# EAGLE design vestee main (EAGLE 7.5.0)
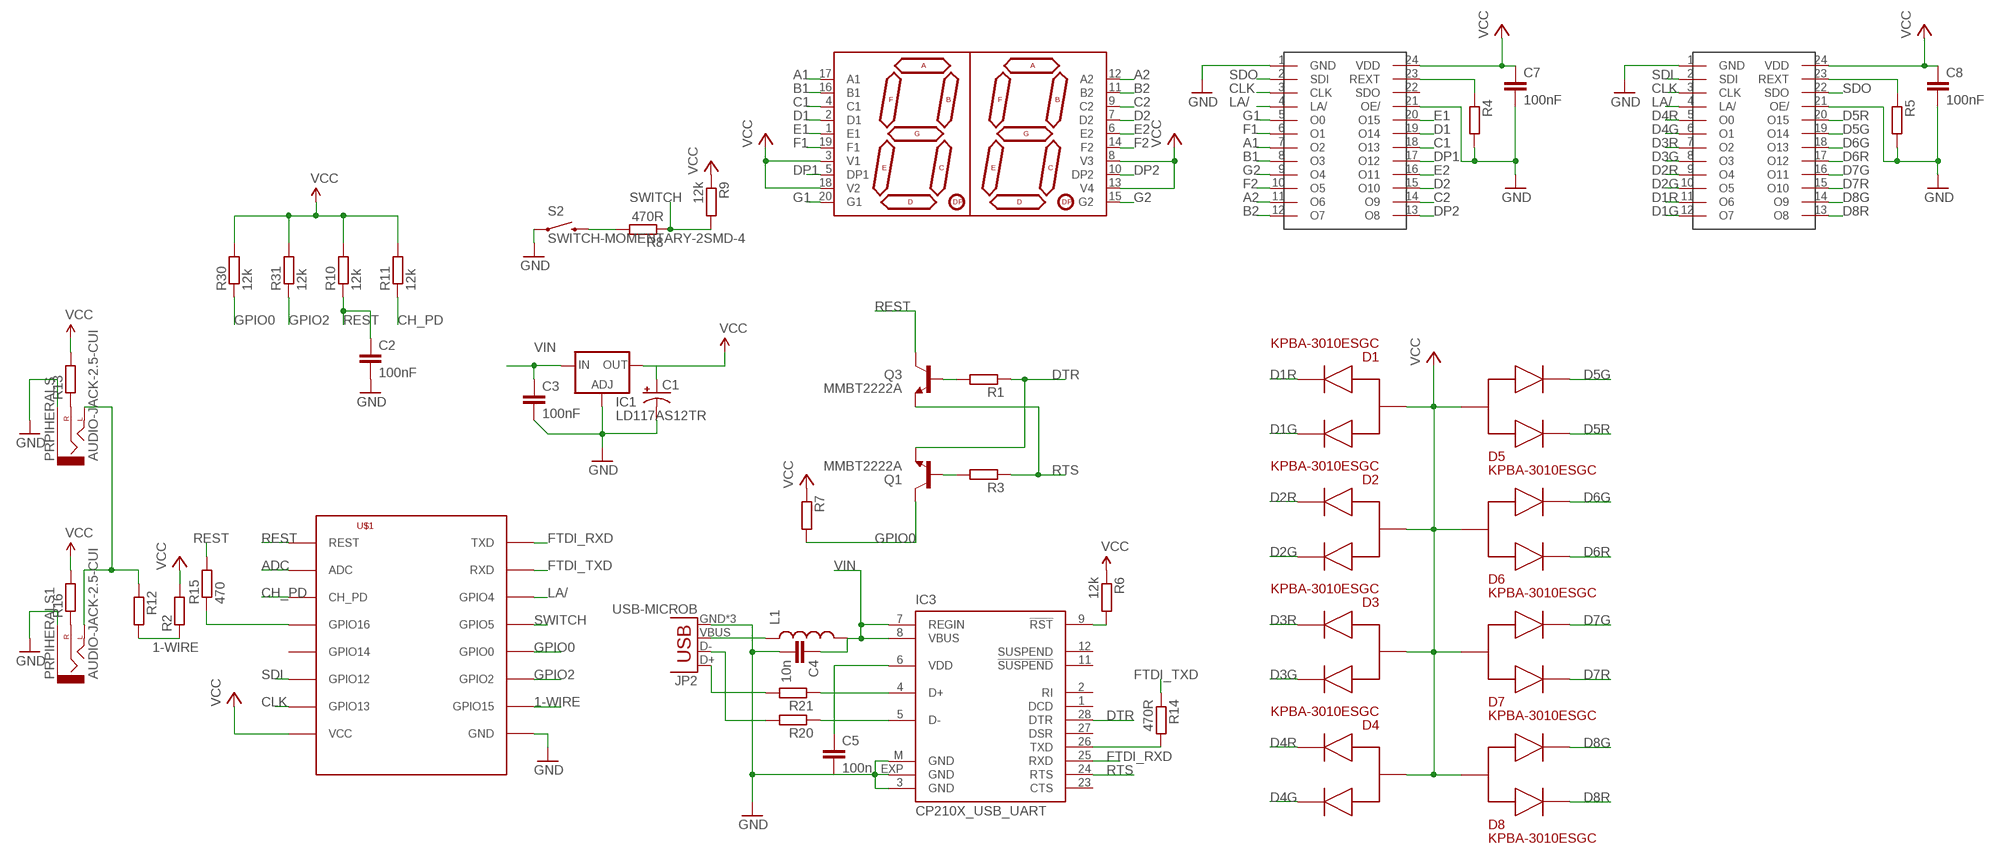
[diagram p0: schematic, sheet 1]

## Parts
C1  CAP_POL3528  [EIA3528]
C2  100nF  C-EUC0603  [C0603]
C3  100nF  C-EUC0603  [C0603]
C4  10n  C-EUC0603  [C0603]
C5  100n  C-EUC0603  [C0603]
C7  100nF  C-EUC0603  [C0603]
C8  100nF  C-EUC0603  [C0603]
D1  KPBA-3010ESGC  APA3010SF4C  [APA3010SF4C]
D2  KPBA-3010ESGC  APA3010SF4C  [APA3010SF4C]
D3  KPBA-3010ESGC  APA3010SF4C  [APA3010SF4C]
D4  KPBA-3010ESGC  APA3010SF4C  [APA3010SF4C]
D5  KPBA-3010ESGC  APA3010SF4C  [APA3010SF4C]
D6  KPBA-3010ESGC  APA3010SF4C  [APA3010SF4C]
D7  KPBA-3010ESGC  APA3010SF4C  [APA3010SF4C]
D8  KPBA-3010ESGC  APA3010SF4C  [APA3010SF4C]
IC1  LD117AS12TR  [SOT223]
IC3  CP210X_USB_UART  [MLP28]
JP2  USB-MICROB  [USB-MICROB]
L1  INDUCTOR1210  [1210]
PRPIHERALS  AUDIO-JACK-2.5-CUI  [STEREOJACK2.5_SMD_CUI]
PRPIHERALS1  AUDIO-JACK-2.5-CUI  [STEREOJACK2.5_SMD_CUI]
Q1  MMBT2222A  TRANSISTOR_NPNMMBT2222A  [SOT23-3]
Q3  MMBT2222A  TRANSISTOR_NPNMMBT2222A  [SOT23-3]
R1  R-EU_R0603  [R0603]
R2  R-EU_R0603  [R0603]
R3  R-EU_R0603  [R0603]
R4  R-EU_R0603  [R0603]
R5  R-EU_R0603  [R0603]
R6  12k  R-EU_R0603  [R0603]
R7  R-EU_R0603  [R0603]
R8  470R  R-EU_R0603  [R0603]
R9  12k  R-EU_R0603  [R0603]
R10  12k  R-EU_R0603  [R0603]
R11  12k  R-EU_R0603  [R0603]
R12  R-EU_R0603  [R0603]
R13  R-EU_M1206  [M1206]
R14  470R  R-EU_R0603  [R0603]
R15  470  R-EU_R0603  [R0603]
R16  R-EU_M1206  [M1206]
R20  R-EU_R0603  [R0603]
R21  R-EU_R0603  [R0603]
R30  12k  R-EU_R0603  [R0603]
R31  12k  R-EU_R0603  [R0603]
S2  SWITCH-MOMENTARY-2SMD-4  [TACTILE_SWITCH_TALL]
U$1  ESP8266-07  [ESP-07]
U$2  KCDA02-103  [KCDA02-103]
U$3  SCT2024CSSG  [SSOP24]
U$4  SCT2024CSSG  [SSOP24]

## Nets
1-WIRE: R2.1 R12.2 U$1.GPIO15
A1: U$2.17(A1) U$3.7(O2)
A2: U$2.12(A2) U$3.11(O6)
ADC: U$1.ADC
B1: U$2.16(B1) U$3.8(O3)
B2: U$2.11(B2) U$3.12(O7)
C1: U$2.4(C1) U$3.18(O13)
C2: U$2.9(C2) U$3.14(O9)
CH_PD: R11.1 U$1.CH_PD
CLK: U$1.GPIO13 U$3.3(CLK) U$4.3(CLK)
D1: U$2.2(D1) U$3.19(O14)
D1G: D1.3 U$4.12(O7)
D1R: D1.2 U$4.11(O6)
D2: U$2.7(D2) U$3.15(O10)
D2G: D2.3 U$4.10(O5)
D2R: D2.2 U$4.9(O4)
D3G: D3.3 U$4.8(O3)
D3R: D3.2 U$4.7(O2)
D4G: D4.3 U$4.6(O1)
D4R: D4.2 U$4.5(O0)
D5G: D5.3 U$4.19(O14)
D5R: D5.2 U$4.20(O15)
D6G: D6.3 U$4.18(O13)
D6R: D6.2 U$4.17(O12)
D7G: D7.3 U$4.16(O11)
D7R: D7.2 U$4.15(O10)
D8G: D8.3 U$4.14(O9)
D8R: D8.2 U$4.13(O8)
DP1: U$2.5(DP1) U$3.17(O12)
DP2: U$2.10(DP2) U$3.13(O8)
DTR: IC3.28(DTR) Q1.2(E) R1.1
E1: U$2.1(E1) U$3.20(O15)
E2: U$2.6(E2) U$3.16(O11)
F1: U$2.19(F1) U$3.6(O1)
F2: U$2.14(F2) U$3.10(O5)
FTDI_RXD: IC3.25(RXD) U$1.TXD
FTDI_TXD: R14.1 U$1.RXD
G1: U$2.20(G1) U$3.5(O0)
G2: U$2.15(G2) U$3.9(O4)
GND: C1.C(-) C2.2 C3.2 C4.2 C5.2 C7.2 C8.2 IC1.1(ADJ) IC3.3(GND) IC3.EXP(GND) IC3.M(GND) JP2.GND JP2.MT1(GND) JP2.MT2(GND) PRPIHERALS1.1(SLEEVE) PRPIHERALS.1(SLEEVE) R4.2 R5.2 S2.A2 U$1.GND U$3.1(GND) U$3.21(OE/) U$4.1(GND) U$4.21(OE/)
GPIO0: Q1.3(C) R7.2 R30.1 U$1.GPIO0
GPIO2: R31.1 U$1.GPIO2
GPIO16: R15.1 U$1.GPIO16
JACK: PRPIHERALS1.3(LEFT) PRPIHERALS.3(LEFT) R12.1
LA/: U$1.GPIO4 U$3.4(LA/) U$4.4(LA/)
N$1: R4.1 U$3.23(REXT)
N$2: JP2.D+ R21.2
N$3: JP2.D- R20.2
N$4: R5.1 U$4.23(REXT)
N$5: Q3.1(B) R1.2
N$6: PRPIHERALS.2(RIGHT) R13.1
N$7: JP2.VBUS L1.1
N$8: PRPIHERALS1.2(RIGHT) R16.1
N$9: C5.1 IC3.6(VDD)
N$14: IC3.9(!RST) R6.2
N$15: Q1.1(B) R3.2
N$18: R8.2 S2.B2
N$28: IC3.4(D+) R21.1
N$29: IC3.5(D-) R20.1
REST: C2.1 Q3.3(C) R10.1 R15.2 U$1.REST
RTS: IC3.24(RTS) Q3.2(E) R3.1
SDI: U$1.GPIO12 U$4.2(SDI)
SDO: U$3.2(SDI) U$4.22(SDO)
SWITCH: R8.1 R9.2 U$1.GPIO5
TXD: IC3.26(TXD) R14.2
VCC: C1.A(+) C7.1 C8.1 D1.COM D2.COM D3.COM D4.COM D5.COM D6.COM D7.COM D8.COM IC1.4(OUT) R2.2 R6.1 R7.1 R9.1 R10.2 R11.2 R13.2 R16.2 R30.2 R31.2 U$1.VCC U$2.3(V1) U$2.8(V3) U$2.13(V4) U$2.18(V2) U$3.24(VDD) U$4.24(VDD)
VIN: C3.1 C4.1 IC1.3(IN) IC3.7(REGIN) IC3.8(VBUS) L1.2
Unconnected: IC3.1(DCD) IC3.2(RI) IC3.11(!SUSPEND) IC3.12(SUSPEND) IC3.23(CTS) IC3.27(DSR) U$1.GPIO14 U$3.22(SDO)

## Library data of the parts
C1 = SparkFun-Passives:CAP_POL: Capacitor Polarized These are standard SMD and PTH capacitors. Normally 10uF, 47uF, and 100uF in electrolytic and tantalum varieties. Always verify the external diameter of the through hole cap, it varies with capacity, voltage, and manufacturer. The EIA devices should be standard.
C2-C5 C7 C8 = rcl:C-EU: CAPACITOR, European symbol
D1-D8 = SparkFun-LED:APA3010SF4C: DIO-10854 Right-angle 880nm SMT infrared LED; PROD_ID: DIO-10854
IC1 = v-reg:LD117A?*: Low drop fixed and adjustable positive voltage regulators 1 A Source: http://www.st.com/stonline/products/literature/ds/7194/ld1117axx.pdf
IC3 = SparkFun-DigitalIC:CP210X_USB_UART: Single-Chip USB to UART Bridge Source: www.silabs.com .. CP2101.pdf / cp2102.pdf. Spark Fun Electronics SKU : COM-00310
JP2 = SparkFun-Connectors:USB: USB Connectors USB-B-PTH is fully proven SKU : PRT-00139/CONN-08278 USB-miniB is fully proven SKU : PRT-00587 USB-A-PCB is untested. USB-A-H is throughly reviewed, but untested. Spark Fun Electronics SKU : PRT-00437 USB-B-SMT is throughly reviewed, but untested. Needs silkscreen touching up. USB-A-S has not been used/tested USB-MB-H has not been used/tested USB-MICROB has been used. CONN-09505; PROD_ID: CONN-09505
L1 = SparkFun-Passives:INDUCTOR: Inductors Basic Inductor/Choke - 0603 and 1206. Footprints are not proven and vary greatly between part numbers. INDUCTOR POWER 3.3UH 4.0A SMD 0.197" L x 0.197" W x 0.177" H (5.00mm x 5.00mm x 4.50mm)
PRPIHERALS PRPIHERALS1 = SparkFun-Connectors:AUDIO-JACK-2.5-CUI
Q1 Q3 = SparkFun-DiscreteSemi:TRANSISTOR_NPN: Generic NPN BJT MMBT2222A - TRANS-08049 (SOT-23, 1A 40V) MPSA42 - TRANS-09116 (SOT-23, 500mA 300V) MMBT5088LT1G - TRANS-11160 (SOT-23, 50 mA 30V) BC547 - COM-08928 <http://www.sparkfun.com/products/8928> (TO-92 45V 100mA) (1.Collector 2.Base 3.Emitter) 2N3904 - COM-00521 <http://www.sparkfun.com/products/521> (TO-92 40V 200mA) (1.Emitter 2.Base 3.Collector) P2N2222A - COM-12852 <http://www.sparkfun.com/products/12852> (TO-92 40V 600mA) (1.Collector 2.Base 3.Emitter); PROD_ID: TRANS-08049
R1-R16 R20 R21 R30 R31 = rcl:R-EU_: RESISTOR, European symbol
S2 = SparkFun-Electromechanical:SWITCH-MOMENTARY-2: Various NO switches- pushbuttons, reed, etc; PROD_ID: SWCH-11966
U$1 = lio:ESP8266
U$2 = vestee:KCDA02-103
U$3 U$4 = vestee:SCT2024CSSG

## Board
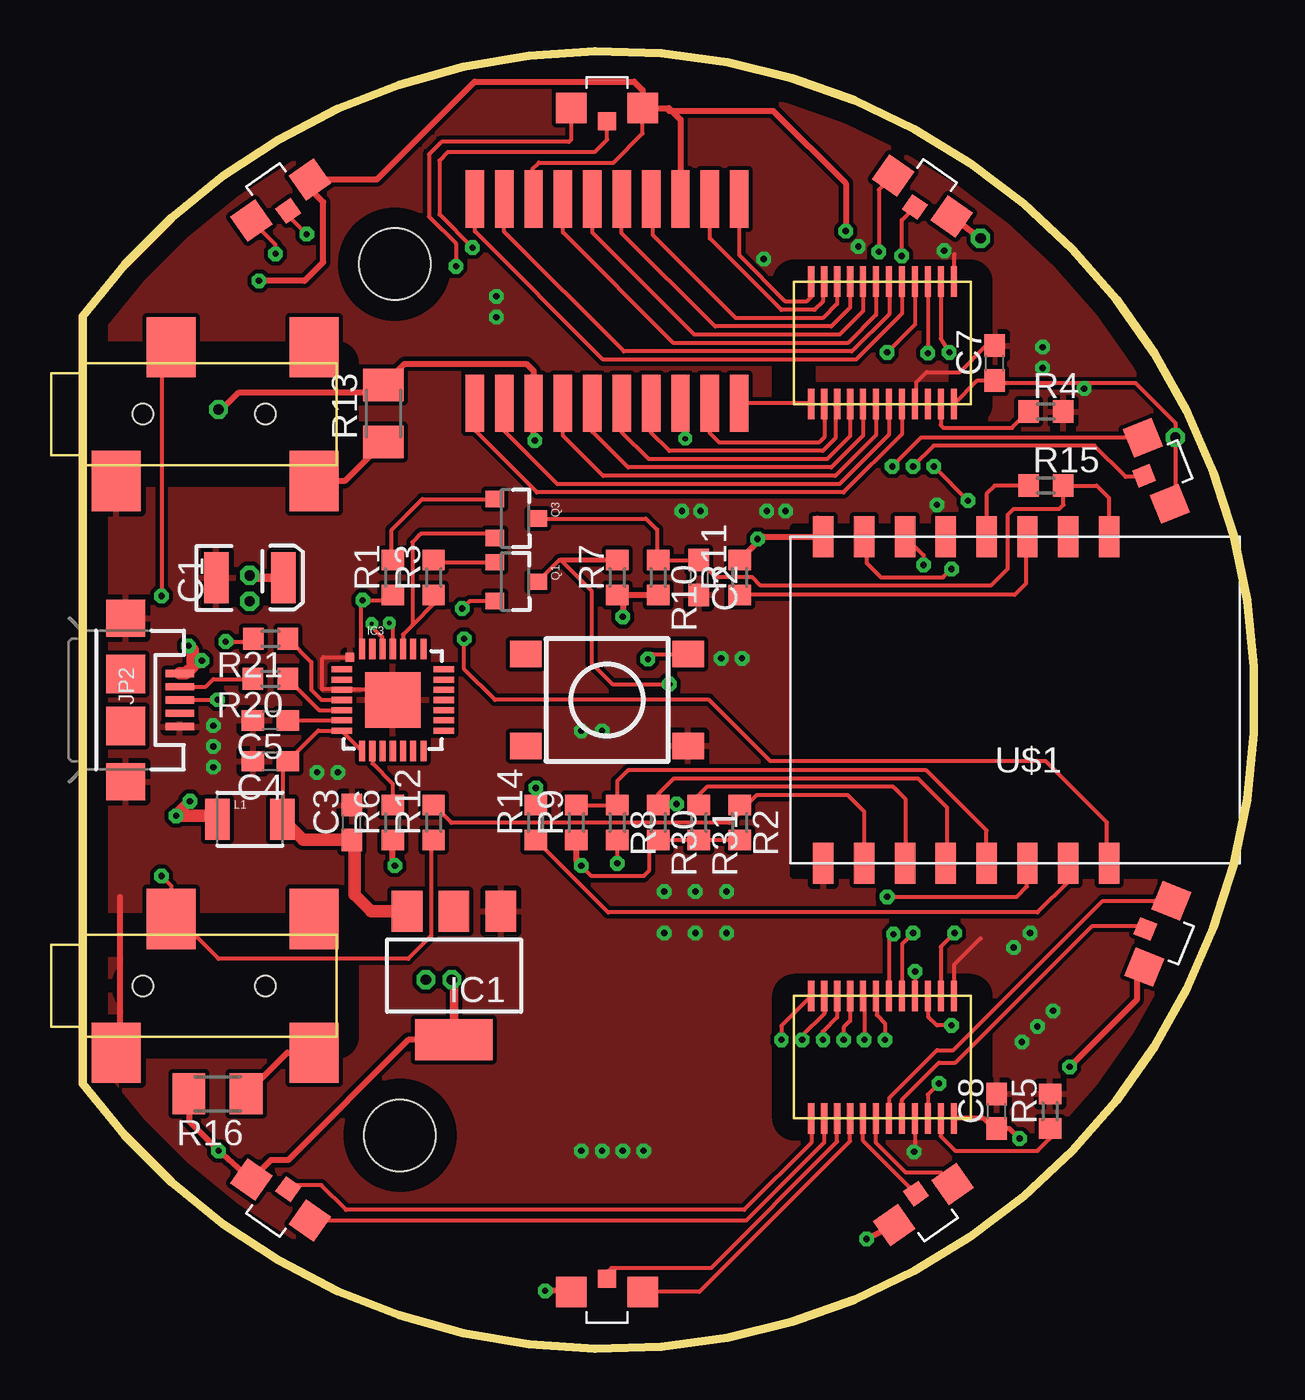
[diagram p1: board, top side]
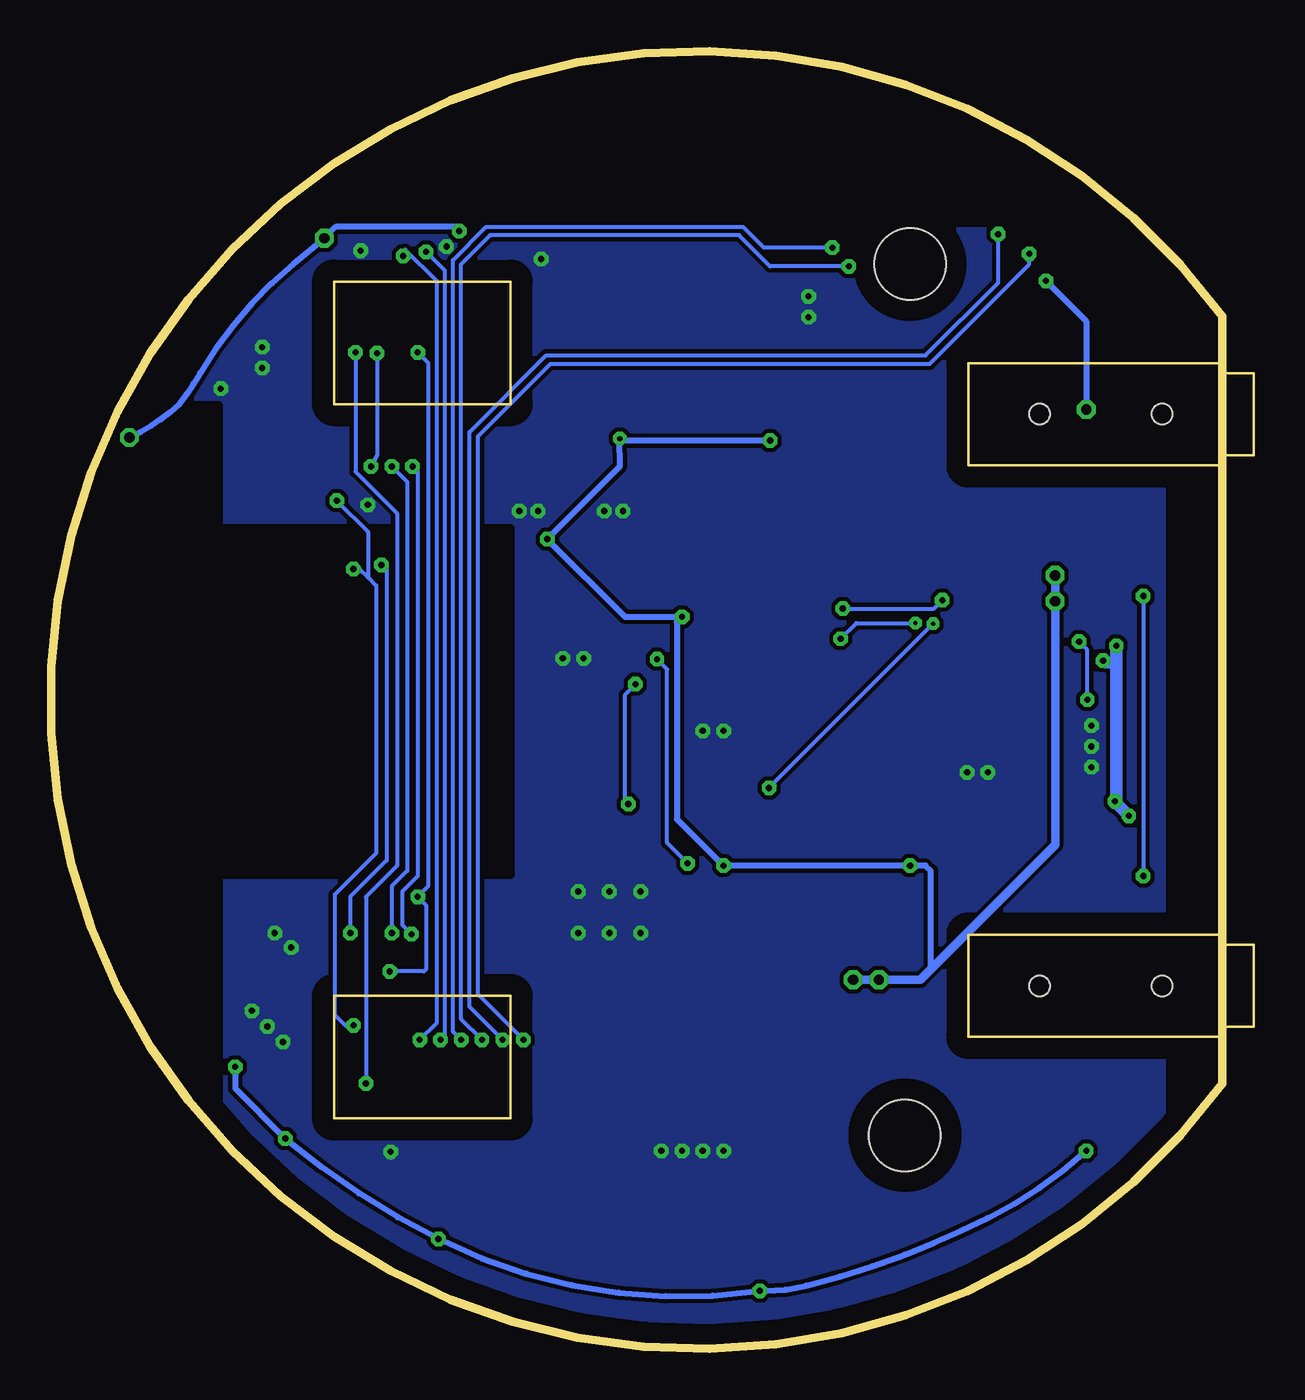
[diagram p2: board, bottom side, seen from below]

Size 57.4 x 63.58 mm. Coordinates in mm from the lower left corner, seen from the top.
Outline: 0,50.59 0,12.99 arc288 0,50.59
Copper layers (1*16): Top 0.035mm / dielectric 1.5mm / Bottom 0.035mm
Design rules "default": minimum track width 10mil, minimum drill 24mil, track to track 8mil, track to pad 8mil, pad to pad 8mil, via to via 8mil, smd to smd 8mil, copper to edge 40mil, drill to drill 8mil, minimum pad ring 10mil, minimum via ring 8mil, stop-mask expansion 4mil, vias tented up to drill 0mil, thermal gap 10mil
Holes 3.5 mm at 15.3,53.14 15.55,10.47
tRestrict: area 34.9,23.2 to 56.9,40.2
bRestrict: area 34.9,23.2 to 56.9,40.2; area -1.7,66.7 to -1.6,67.8; area -0.7,55.2 to 53.4,67.4; area -12.4,-3.8 to 2.5,43.2; area 49.2,3.4 to 70.9,46.2

### Footprints (pad centres in the part's own frame; a part is rotated, then mirrored left to right if it is on the bottom)
EIA3528 = smd 1.2 x 2.5: A 1.65,0; C -1.65,0
C0603 = smd 1.1 x 1: 1 -0.85,0; 2 0.85,0
APA3010SF4C = smd 0.9 x 0.9: 2 0.65,0 | smd 1.5 x 1.5: 3 0,-1.75; COM 0,1.75
SOT223 = smd 1.5 x 2: 1 -2.3,-3.15; 2 0,-3.15; 3 2.3,-3.15 | smd 3.8 x 2: 4 0,3.15
MLP28 = smd 1 x 0.3: 1 -2.5,1.5; 2 -2.5,1; 3 -2.5,0.5; 4 -2.5,0; 5 -2.5,-0.5; 6 -2.5,-1; 7 -2.5,-1.5; 15 2.5,-1.5; 16 2.5,-1; 17 2.5,-0.5; 18 2.5,0; 19 2.5,0.5; 20 2.5,1; 21 2.5,1.5 | smd 0.3 x 1: 8 -1.5,-2.5; 9 -1,-2.5; 10 -0.5,-2.5; 11 0,-2.5; 12 0.5,-2.5; 13 1,-2.5; 14 1.5,-2.5; 22 1.5,2.5; 23 1,2.5; 24 0.5,2.5; 25 0,2.5; 26 -0.5,2.5; 27 -1,2.5; 28 -1.5,2.5 | smd 2.7 x 2.7: EXP 0,0 | smd 0.435 x 0.435: M -2.103,2.103
USB-MICROB = smd 0.35 x 1.4: D+ 0,2.65; D- -0.65,2.65; GND 1.3,2.65; ID 0.65,2.65; VBUS -1.3,2.65 | smd 1.8 x 1.9: MT1 -4,0; MT2 4,0 | smd 1.9 x 1.9: P$1 -1.27,0; P$2 1.27,0
1210 = smd 1.2 x 2: 1 -1.6,0; 2 1.6,0
STEREOJACK2.5_SMD_CUI = smd 2.4 x 2.95: 1 1.7,-3.275; 2 11.4,-3.275; 3 4.4,3.275; 4 11.4,3.275 | hole 1: 9,0; 3,0
SOT23-3 = smd 0.8 x 0.9: 1 -0.95,-1; 2 0.95,-1; 3 0,1.1
R0603 = smd 1 x 1.1: 1 -0.85,0; 2 0.85,0
M1206 = smd 1.6 x 2: 1 -1.4,0; 2 1.4,0
TACTILE_SWITCH_TALL = smd 1.55 x 1.3: A1 -3.975,-2.25; A2 3.975,-2.25; B1 -3.975,2.25; B2 3.975,2.25
ESP-07 = smd 1 x 2: ADC -1.6,-8; CH_PD 0.4,-8; GND 10.4,8; GPIO0 4.4,8; GPIO2 6.4,8; GPIO4 0.4,8; GPIO5 2.4,8; GPIO12 6.4,-8; GPIO13 8.4,-8; GPIO14 4.4,-8; GPIO15 8.4,8; GPIO16 2.4,-8; REST -3.6,-8; RXD -1.6,8; TXD -3.6,8; VCC 10.4,-8
KCDA02-103 = smd 0.9 x 2.8: 1 -6.48,-4.96; 2 -5.04,-4.96; 3 -3.6,-4.96; 4 -2.16,-4.96; 5 -0.72,-4.96; 6 0.72,-4.96; 7 2.16,-4.96; 8 3.6,-4.96; 9 5.04,-4.96; 10 6.48,-4.96; 11 6.48,5.04; 12 5.04,5.04; 13 3.6,5.04; 14 2.16,5.04; 15 0.72,5.04; 16 -0.72,5.04; 17 -2.16,5.04; 18 -3.6,5.04; 19 -5.04,5.04; 20 -6.48,5.04
SSOP24 = smd 0.3 x 1.5: 1 -3.493,-3; 2 -2.857,-3; 3 -2.223,-3; 4 -1.587,-3; 5 -0.953,-3; 6 -0.318,-3; 7 0.318,-3; 8 0.953,-3; 9 1.587,-3; 10 2.223,-3; 11 2.857,-3; 12 3.493,-3; 13 3.493,3; 14 2.857,3; 15 2.223,3; 16 1.587,3; 17 0.953,3; 18 0.318,3; 19 -0.318,3; 20 -0.953,3; 21 -1.587,3; 22 -2.223,3; 23 -2.857,3; 24 -3.493,3

### Placement (x,y rotation side)
C1  8.2,37.79 0 top
C2  30.2,37.79 270 top
C3  13.2,25.79 90 top
C4  9.2,28.79 180 top
C5  9.2,30.79 180 top
C7  44.7,48.3 90 top
C8  44.8,11.64 90 top
D1  9.7,56.29 305 top
D2  25.7,60.79 270 top
D3  41.16,56.48 235 top
D4  52.62,43.02 202 top
D5  52.69,20.33 158 top
D6  41.21,7.07 125 top
D7  25.7,2.79 90 top
D8  9.7,7.29 55 top
IC1  18.2,18.29 180 top
IC3  15.2,31.79 0 top
JP2  2.11,31.79 270 top
L1  8.2,25.95 0 top
PRPIHERALS  -0.05,45.79 0 top
PRPIHERALS1  -0.05,17.79 0 top
Q1  21.2,37.59 270 top
Q3  21.2,40.68 270 top
R1  15.2,37.79 90 top
R2  32.2,25.79 270 top
R3  17.2,37.79 90 top
R4  47.2,45.92 0 top
R5  47.41,11.65 90 top
R6  15.2,25.79 90 top
R7  26.2,37.79 90 top
R8  26.2,25.79 270 top
R9  24.2,25.79 90 top
R10  28.2,37.79 270 top
R11  32.2,37.79 90 top
R12  17.2,25.79 90 top
R13  14.74,45.83 90 top
R14  22.2,25.79 90 top
R15  47.2,42.29 0 top
R16  6.61,12.5 180 top
R20  9.2,32.83 180 top
R21  9.21,34.79 180 top
R30  28.2,25.79 270 top
R31  30.2,25.79 270 top
S2  25.7,31.79 0 top
U$1  46.7,31.79 180 top
U$2  25.7,51.29 0 top
U$3  39.2,49.29 180 top
U$4  39.2,14.29 180 top

### Tracks (layer width: path | path; a pad name or v marks a point on that pad's centre or on a via)
1-WIRE
  Top 0.203: U$1.GPIO15 38.31,26.32 37.5,27.13 33.03,27.13 32.54,26.64 R2.1 32.2,26.27 31.7,25.77 18.07,25.77 R12.2
A1
  Top 0.203: U$3.7 38.88,50.66 37.5,49.28 28.96,49.28 23.54,54.7 U$2.17
A2
  Top 0.203: U$3.11 36.28,52.23 36.28,51.31 35.87,50.91 34.25,50.91 30.74,54.41 U$2.12
B1
  Top 0.203: U$3.8 38.25,50.84 37.09,49.69 29.98,49.69 24.98,54.69 U$2.16
B2
  Top 0.203: U$3.12 35.71,51.55 35.47,51.31 34.45,51.31 32.18,53.58 U$2.11
C1
  Top 0.203: U$3.18 38.88,44.77 36.89,42.78 25.51,42.78 23.54,44.75 U$2.4
C2
  Top 0.203: U$3.14 36.34,44.67 36.08,44.4 31.2,44.4 30.74,44.86 U$2.9
CH_PD
  Top 0.203: U$1.CH_PD 46.23,39.73 46.23,37.49 45.68,36.94 R11.1
CLK  (via drill 0.3)
  Top 0.203: U$3.3 v41.42,48.78 | U$1.GPIO13 38.41,39.9 38.41,38.51 39.12,37.8 42.17,37.8 v42.58,38.21 | v41.71,43.23 v43.39,41.56 | v42.58,15.85 41.87,15.85 41.46,16.26 41.46,17.25 U$4.3
  Bottom 0.203: v41.42,48.78 41.42,43.78 v41.71,43.23 | v43.39,41.56 41.87,40.03 41.87,37.8 | 41.87,37.8 41.46,37.39 41.46,24.29 43.49,22.25 43.49,16.36 42.98,15.85 v42.58,15.85 | 41.87,37.8 42.27,38.21 v42.58,38.21
D1
  Top 0.203: U$3.19 39.52,44.8 37.09,42.37 23.27,42.37 20.66,44.98 U$2.2
D1G  (via drill 0.3, 0.3 pad 0.6)
  Top 0.203: U$4.12 34.25,15.83 v34.25,15.14 | v9.46,53.65 9.46,54.1 D1.3
  Bottom 0.203: v34.25,15.14 36.48,17.38 36.48,44.71 32.93,48.26 14.33,48.26 9.46,53.14 v9.46,53.65
D1R  (via drill 0.3, 0.3 pad 0.6)
  Top 0.203: U$4.11 36.34,16.43 35.26,15.35 v35.26,15.14 | v10.98,54.61 10.07,55.52 D1.2
  Bottom 0.203: v35.26,15.14 36.89,16.77 36.89,44.91 33.13,48.67 14.54,48.67 10.98,52.23 v10.98,54.61
D2
  Top 0.203: U$3.15 36.92,46.23 36.89,46.23 36.89,44.61 36.28,44 28.76,44 27.86,44.9 U$2.7
D2G  (via drill 0.3, 0.3 pad 0.6)
  Top 0.203: U$4.10 36.98,16.25 36.28,15.55 v36.28,15.14 | D2.3 23.95,59.25 23.83,59.13 17.58,59.13 16.97,58.53 16.97,55.48 18.29,54.16 v18.29,53.04
  Bottom 0.203: v36.28,15.14 37.29,16.16 37.29,53.14 35.87,54.56 23.68,54.56 22.16,53.04 v18.29,53.04
D2R  (via drill 0.3, 0.3 pad 0.6)
  Top 0.203: U$4.9 37.61,16.07 37.29,15.75 v37.29,15.14 | D2.2 25.7,59.25 25.08,58.63 17.89,58.63 17.48,58.22 17.48,55.58 v19.11,53.95
  Bottom 0.203: v37.29,15.14 37.7,15.55 37.7,53.34 36.08,54.97 23.48,54.97 22.46,53.95 v19.11,53.95
D3G  (via drill 0.3, 0.3 pad 0.6)
  Top 0.203: U$4.8 38.31,17.23 v38.31,15.14 | 39.73,57.2 D3.3 39.02,56.78 v39.02,53.75
  Bottom 0.203: v39.02,53.75 38.11,52.84 38.11,15.35 v38.31,15.14
D3R  (via drill 0.3, 0.3 pad 0.6)
  Top 0.203: U$4.7 38.92,17.25 38.92,16.36 39.33,15.95 v39.33,15.14 | 40.79,55.62 D3.2 40.14,55.3 v40.14,53.55
  Bottom 0.203: v39.33,15.14 38.51,15.95 38.51,52.33 40.04,53.85 v40.14,53.55
D4G  (via drill 0.3)
  Top 0.203: D4.3 41.09,44.65 v39.68,43.23 | v39.73,20.32 39.52,20.11 U$4.6
  Bottom 0.203: v39.68,43.23 39.43,42.98 39.43,23.17 40.19,22.41 40.19,20.78 v39.73,20.32
D4R  (via drill 0.3)
  Top 0.203: D4.2 51.97,42.73 51.11,42.73 49.59,44.25 41.71,44.25 v40.7,43.23 | v40.7,20.37 40.15,19.83 U$4.5
  Bottom 0.203: v40.7,43.23 39.94,42.47 39.94,23.42 40.7,22.66 v40.7,20.37
D5G
  Top 0.203: U$4.19 39.53,11.3 39.53,12.3 41.87,14.63 42.68,14.63 50,21.96 D5.3
D5R
  Top 0.203: U$4.20 40.15,12.21 41.97,14.02 42.78,14.02 49.49,20.73 51.93,20.73 D5.2
D6G
  Top 0.203: D6.3 42.08,8.64 40.34,8.64 38.88,10.1 U$4.18
D6R
  Top 0.203: D6.2 38.25,10.19 U$4.17
D7G
  Top 0.203: D7.3 30.23,2.79 37.61,10.18 U$4.16
D7R
  Top 0.203: D7.2 25.7,3.75 25.92,3.97 30.79,3.97 36.98,10.15 U$4.15
D8G
  Top 0.203: D8.3 32.51,6.29 36.34,10.13 U$4.14
D8R
  Top 0.203: U$4.13 35.71,10.1 32.42,6.81 12.91,6.81 11.69,8.03 10.28,8.03 D8.2
DP1
  Top 0.203: U$3.17 38.25,44.75 36.69,43.18 26.73,43.18 24.98,44.93 U$2.5
DP2
  Top 0.203: U$3.13 35.67,46.33 U$2.10
DTR  (via drill 0.3 pad 0.6)
  Top 0.203: Q1.2 18.96,36.64 v18.6,36.27 | v13.72,36.68 14.94,36.68 R1.1 | 13.7,36.66 v13.72,36.68 | IC3.28 13.65,34.34 13.65,36.61 v13.72,36.68
  Bottom 0.203: v18.6,36.27 14.13,36.27 v13.72,36.68
E1
  Top 0.203: U$3.20 40.14,46.28 40.14,44.81 37.29,41.96 22.26,41.96 19.22,45 U$2.1
E2
  Top 0.203: U$3.16 37.61,44.72 36.48,43.59 27.74,43.59 26.42,44.91 U$2.6
F1
  Top 0.203: U$3.6 39.53,52.28 39.53,50.7 37.7,48.87 26.53,48.87 20.66,54.74 U$2.19
F2
  Top 0.203: U$3.10 36.98,51.2 36.28,50.5 32.01,50.5 27.95,54.56 27.95,56.25 U$2.14
FTDI_RXD  (via drill 0.2 pad 0.6, 0.3 pad 0.6)
  Top 0.203: U$1.TXD 50.2,23.89 50.2,25.79 47.2,28.79 33.7,28.79 30.7,31.79 20.2,31.79 18.7,33.29 v18.7,34.79 | v15.03,35.56 15.2,35.39 IC3.25
  Bottom 0.203: v18.7,34.79 17.93,35.56 v15.03,35.56
FTDI_TXD
  Top 0.203: R14.1 25.75,21.39 46.8,21.39 48.3,22.89 U$1.RXD
G1
  Top 0.203: U$3.5 40.15,50.72 37.9,48.47 25.51,48.47 19.22,54.76 U$2.20
G2
  Top 0.203: U$3.9 37.61,51.02 36.69,50.09 31,50.09 26.42,54.67 U$2.15
GND  (via drill 0.3)
  Top 0.203: U$4.1 42.73,17.33 42.73,18.85 44,20.12 | 12.68,32.31 IC3.3 12.72,32.31 | 12.68,32.31 11.74,32.31 11.74,33.84 11.8,33.89 IC3.M | 12.72,32.31 14.79,32.31 15.2,31.9 IC3.EXP | 12.72,32.31 12.68,32.31 | U$3.1 42.73,52.33 42.73,53.65 | U$4.21 40.79,9.69 v40.75,9.66 | U$3.21 40.85,46.36 40.85,47.35 41.36,47.86 42.98,47.86 44.28,49.15 C7.2
  Top 0.305: PRPIHERALS1.1 1.84,14.7 1.84,22.15
  Bottom 0.203: v40.75,9.66 40.75,9.35
  other vias: 24.44,9.71 25.46,9.71 26.47,9.71 27.49,9.71 6.41,30.53 6.41,29.52 6.41,28.5 47.56,16.56 46.79,15.8 46.03,15.04 45.63,19.66 28.51,22.41 30.03,22.41 31.55,22.41 31.55,20.37 30.03,20.37 28.51,20.37 12.5,28.25 11.49,28.25 24.44,30.28 25.46,30.28 31.3,33.84 32.32,33.84 33.38,53.39 47.05,49.08 47.05,48.06 49.08,47.04 20.28,51.57 20.28,50.55 42.22,53.8 38.02,54.01 46.44,20.37 41.87,41.35 34.45,41.05 33.54,41.05 30.28,41.05 29.37,41.05
  pour Top (isolate 0.203): -1.47,52.12 -1.47,11.74 11.23,-0.96 41.46,-0.96 54.16,11.74 58.48,16.06 58.48,44.76 38.16,65.08 15.81,65.08 11.49,65.08
  pour Bottom (isolate 0.203): -1.21,36.38 -1.21,52.63 11.49,65.33 37.9,65.33 58.48,44.76 58.48,15.55 58.22,15.29 57.97,15.29 42.22,-0.45 11.74,-0.45 11.49,-0.71 10.98,-0.71 -1.21,11.48
GPIO0  (via drill 0.3)
  Top 0.203: Q1.3 23.35,38.64 R7.2 26.18,38.66 23.43,38.66 24.95,37.14 24.95,33.58 25.97,32.57 v28.76,32.57 | U$1.GPIO0 42.37,23.87 42.37,26.52 40.95,27.94 28.96,27.94 28.2,27.18 R30.1 29.19,26.64 v29.11,26.69
  Bottom 0.203: v28.76,32.57 29.27,32.06 29.27,26.85 v29.11,26.69
GPIO2
  Top 0.203: U$1.GPIO2 40.34,23.83 40.34,26.93 39.73,27.54 30.59,27.54 30.2,27.15 R31.1
GPIO16
  Top 0.203: R15.1 44.7,42.29 44.3,41.89 U$1.GPIO16
JACK  (via drill 0.3)
  Top 0.203: R12.1 17.08,24.82 17.08,20.23 15.95,19.1 6.66,19.1 4.7,21.07 PRPIHERALS1.3 4.35,22.69 v3.87,23.17 | PRPIHERALS.3 3.87,48.59 v3.87,36.88
  Bottom 0.203: v3.87,36.88 v3.87,23.17
LA/  (via drill 0.3)
  Top 0.203: U$3.4 40.79,50.18 v39.43,48.82 | v39.43,22.15 45.78,22.15 46.29,22.66 46.29,23.78 U$1.GPIO4 | v40.8,18.49 40.79,18.46 U$4.4
  Bottom 0.203: v39.43,48.82 38.92,48.31 38.92,22.66 v39.43,22.15 39.02,21.75 39.02,18.6 39.12,18.49 v40.8,18.49
N$1
  Top 0.203: U$3.23 42.06,45.25 42.19,45.12 45.55,45.12 R4.1
N$2  (via drill 0.3 pad 0.6)
  Top 0.203: JP2.D+ 6.6,31.79 v6.61,31.8 | v7.02,34.65 8.22,34.65 R21.2
  Bottom 0.203: v6.61,31.8 6.61,34.24 v7.02,34.65
N$3
  Top 0.203: JP2.D- 6.03,32.44 6.41,32.82 8.34,32.82 R20.2
N$4
  Top 0.203: U$4.23 42.06,10.43 42.78,9.71 46.79,9.71 47.41,10.32 R5.1
N$5
  Top 0.203: Q3.1 16.64,41.63 15.15,40.14 15.15,38.7 R1.2
N$6
  Top 0.305: R13.1 12.83,42.52 PRPIHERALS.2
N$7  (via drill 0.3, 0.3 pad 0.6)
  Top 0.203: v4.58,26.11 4.63,26.17 4.63,26.22 | v5.26,26.83 5.16,26.73 5.13,26.73
  Top 0.508: v5.84,33.72 5.71,33.58 5.65,33.58 5.39,33.58 | 4.63,26.22 4.63,26.23 5.13,26.73 5.25,26.85
  Top 0.61: JP2.VBUS 5.05,33.09 5.39,33.43 5.39,33.58 5.39,34.24 v5.19,34.45 | v4.58,26.11 6.44,26.11 L1.1
  Bottom 0.203: 5.73,33.58 5.84,33.7 v5.84,33.72
  Bottom 0.508: 5.14,33.58 5.73,33.58 5.83,33.68
  Bottom 0.61: v5.19,34.45 5.19,26.72 v4.58,26.11
N$8
  Top 0.305: R16.1 10.03,14.52 PRPIHERALS1.2
N$9
  Top 0.203: C5.1 IC3.6
N$14
  Top 0.203: IC3.9 14.2,28.69 15.2,27.69 R6.2
N$15
  Top 0.203: R3.2 17.3,38.54 Q1.1
N$18  (via drill 0.3 pad 0.6)
  Top 0.203: R8.2 v26.2,23.79 | v27.7,33.79 27.95,34.04 S2.B2
  Bottom 0.203: v26.2,23.79 27.2,24.79 27.2,33.29 v27.7,33.79
N$28
  Top 0.203: R21.1 11.2,33.65 11.2,32.29 11.7,31.79 IC3.4
N$29
  Top 0.203: R20.1 11.59,31.29 IC3.5
REST
  Top 0.203: U$1.REST 50.3,41.69 49.7,42.29 R15.2 48.06,42.28 48.06,41.35 47.86,41.15 45.63,41.15 45.32,40.85 45.32,38.2 44.51,37.39 33.23,37.39 32.82,37.8 31.04,37.8 C2.1 R10.1 28.15,38.69 28.15,40.14 27.6,40.68 Q3.3
RTS
  Top 0.203: Q3.2 20,39.93 16.57,39.93 16.16,39.53 16.16,35.46 | 16.16,35.46 15.7,35 IC3.24 | R3.1 17.2,36.5 16.16,35.46
SDI  (via drill 0.3)
  Top 0.203: U$1.GPIO12 41.21,38.89 v41.21,38.41 | v42.73,20.37 42.06,19.7 U$4.2
  Bottom 0.203: v41.21,38.41 40.95,38.15 40.95,23.93 42.73,22.15 v42.73,20.37
SDO  (via drill 0.3)
  Top 0.203: U$3.2 42.06,49.5 v42.48,48.82 | v41.97,13.01 41.42,12.46 U$4.22
  Bottom 0.203: v42.48,48.82 42.48,42.98 40.44,40.95 40.44,23.68 41.97,22.15 v41.97,13.01
SWITCH
  Top 0.203: U$1.GPIO5 44.3,25.41 41.36,28.35 26.73,28.35 26.2,27.82 R8.1 R9.2
TXD  (via drill 0.2, 0.3)
  Top 0.203: IC3.26 14.68,34.31 14.68,34.87 14.17,35.38 v14.17,35.53 | v22.21,27.48 v22.2,27.47 R14.2
  Bottom 0.203: v14.17,35.53 v22.21,27.49 v22.21,27.48
VCC  (via drill 0.25, 0.3, 0.51)
  Top 0.203: v24.44,23.68 24.95,23.17 27.49,23.17 27.74,23.42 27.74,24.49 R30.2 R31.2 R2.2 | U$3.24 43.85,47.45 C7.1 44.85,47.3 51.62,47.3 53.55,45.37 v53.55,44.66 53.55,41.67 | 51.62,18.34 51.67,18.34 D5.COM | 15.2,23.77 v15.3,23.68 | 42.69,11.27 U$4.24 | 44.73,10.72 C8.1 | 22.16,56.39 22.05,56.49 22.05,57.81 22.36,58.12 26.02,58.12 27.45,59.55 D2.COM
  Top 0.254: v45.92,10.31 45.43,10.79 C8.1 | 44.73,10.72 44.16,11.29 U$4.24
  Top 0.305: 10.17,38.12 C1.A | 53.65,41.78 D4.COM 53.55,41.67 | v24.44,23.68 24.2,23.92 R9.1 | R7.1 26.47,36.67 | 26.47,36.67 v26.47,35.87 | 26.47,36.67 26.75,36.94 R10.2 | 33.08,39.52 33.35,39.79 U$1.VCC | R11.2 33.08,39.52 | 33.08,39.52 v33.08,39.68 | v22.16,44.5 22.1,44.56 U$2.3 22.1,47.91 21.75,48.26 15.78,48.26 R13.2 14.36,46.84 7.63,46.84 6.81,46.03 v6.66,46.03 | U$2.8 29.52,46.11 v29.53,44.59 | 51.87,18.55 D5.COM | 29.27,56.36 U$2.13 29.3,60.22 28.76,60.76 | U$2.18 22.16,56.39 | D7.COM 23.89,2.85 v22.66,2.85 | D6.COM v38.41,5.39 | 28.76,60.76 28.73,60.79 D2.COM 27.45,61.66 27.03,62.08 19.21,62.08 14.43,57.3 D1.COM 11.13,56.85 11.79,56.19 11.79,53.24 10.88,52.33 v8.64,52.33 | 28.76,60.76 28.76,60.66 33.84,60.66 37.4,57.1 v37.4,54.77 | D3.COM v44,54.41 | 51.67,18.34 51.67,17.12 v48.37,13.82 | R16.2 5.21,11.16 v6.66,9.71 D8.COM 9.22,9.25 10.07,9.25 15.96,15.14 IC1.4 | 15.2,23.77 R6.1
  Top 0.406: U$1.VCC 36.01,40.61 | IC1.4 18.2,17.98 v18.09,18.09 | v8.19,37.9 8.29,37.79 C1.A
  Bottom 0.203: v29.53,44.59 v29.52,44.59 29.52,44.5
  Bottom 0.305: v6.66,46.03 6.66,50.35 v8.64,52.33 | v53.55,44.66 arc-19 51.11,46.28 arc-5 50.1,47.81 arc19 45.52,53.14 v44,54.41 | 14.79,18.09 14.28,18.6 14.28,23.42 14.54,23.68 v15.3,23.68 v24.44,23.68 26.73,25.96 26.73,35.61 v26.47,35.87 29.27,35.87 v33.08,39.68 29.52,43.23 v29.53,44.59 | v22.16,44.5 29.52,44.5 | v6.66,9.71 arc16 11.49,6.4 arc6 15.55,4.63 arc7 20.38,3.1 arc14 22.41,2.85 v22.66,2.85 arc35 v38.41,5.39 arc14 v45.92,10.31 48.37,12.76 v48.37,13.82 | v44,54.41 43.75,54.66 | v37.4,54.77 37.6,54.97 43.44,54.97 v44,54.41
  Bottom 0.406: v18.09,18.09 v16.82,18.09 14.79,18.09 8.19,24.69 v8.19,36.63 v8.19,37.9
VIN
  Top 0.203: L1.2 9.8,28.54 C4.1 11.55,30.29 IC3.7 IC3.8
  Top 0.61: L1.2 10.81,24.94 C3.1 13.32,24.83 13.32,22.25 14.13,21.44 IC1.3

### Text on the board
117bmp: VESTEE